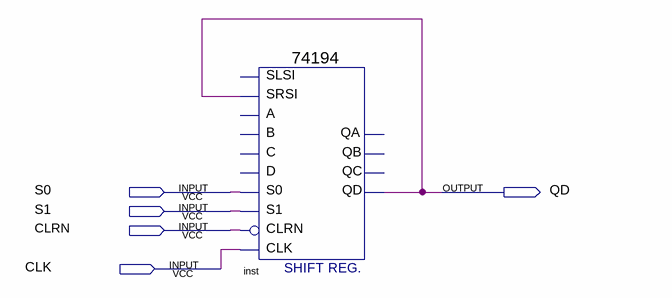
[diagram p0: schematic sheet]
// Quartus schematic Block6.bdf as structural Verilog: 1 symbols, 5 pins
module Block6 (
  input  S0,
  input  S1,
  input  CLRN,
  input  CLK,
  output QD
);

  \74194  inst (.SRSI(QD), .CLK(CLK), .CLRN(CLRN), .S1(S1), .S0(S0), .QD(QD));  // open: SLSI, B, C, D, A, QA, QB, QC
endmodule
